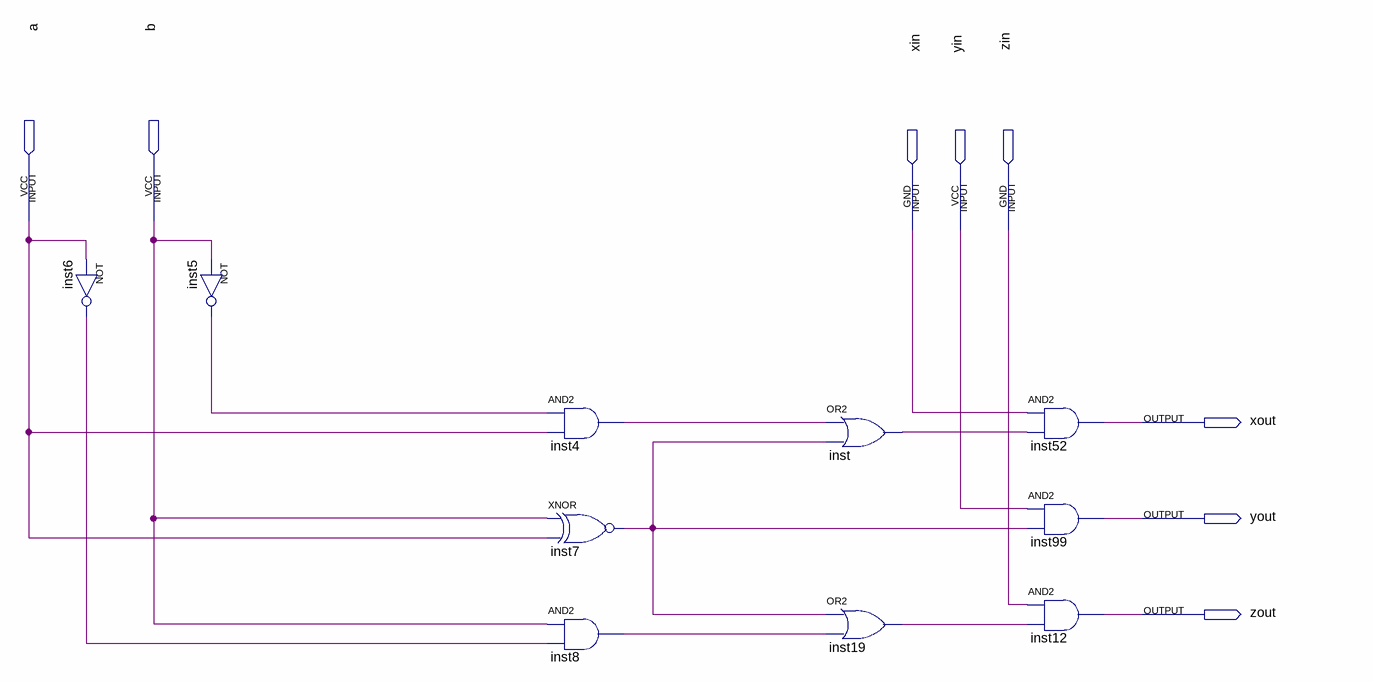
[diagram p0: schematic sheet]
// Quartus schematic Cmp1bit.bdf as structural Verilog: 10 symbols, 8 pins
module Cmp1bit (
  input  a,
  input  b,
  input  xin,
  input  yin,
  input  zin,
  output xout,
  output yout,
  output zout
);

  wire inst4_out, inst5_out, inst6_out, inst7_out, inst8_out, inst19_out, inst_out;

  not inst6 (inst6_out, a);
  not inst5 (inst5_out, b);
  and inst4 (inst4_out, inst5_out, a);
  xnor inst7 (inst7_out, b, a);
  and inst8 (inst8_out, b, inst6_out);
  or inst (inst_out, inst4_out, inst7_out);
  or inst19 (inst19_out, inst7_out, inst8_out);
  and inst52 (xout, xin, inst_out);
  and inst99 (yout, yin, inst7_out);
  and inst12 (zout, zin, inst19_out);
endmodule
